# Altium schematic sheet power&down.SchDoc
size A4
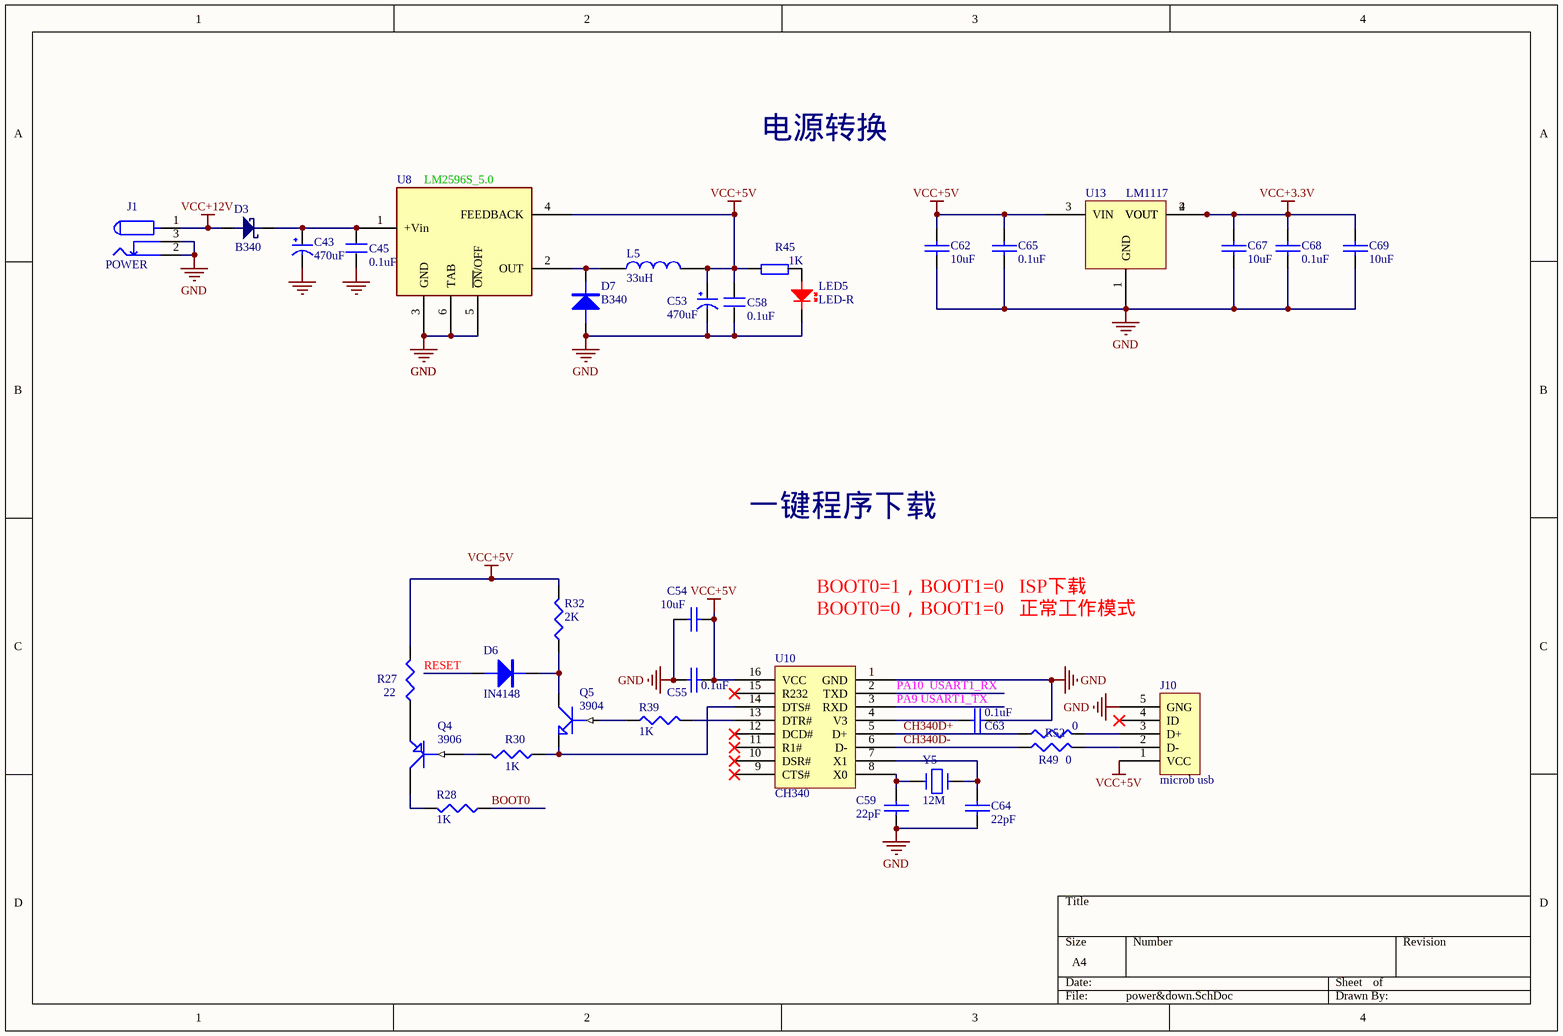
[diagram p0: power&down.SchDoc]

## Parts
C43  470uF  [RB5.0-8]
C45  0.1uF  [0603]
C53  470uF  [RB5.0-8]
C54  10uF  [0805]
C55  0.1uF  [0603]
C58  0.1uF  [0603]
C59  22pF  [0603]
C62  10uF  [0805]
C63  0.1uF  [0603]
C64  22pF  [0603]
C65  0.1uF  [0603]
C67  10uF  [0805]
C68  0.1uF  [0603]
C69  10uF  [0805]
D3  B340  [SMB]
D6  IN4148  [SOD-23]
D7  B340  [SMB]
J1  POWER  [DC10B]
J10  microb usb  [USB_micro]
L5  33uH  [INDUCTOR-1212]
LED5  LED-R  [LED-0805]
Q4  3906  [SOT-23]
Q5  3904  [SOT-23]
R27  22  [0603]
R28  1K  [0603]
R30  1K  [0603]
R32  2K  [0603]
R39  1K  [0603]
R45  1K  [0603]
R49  0  [0603]
R52  0  [0603]
U8  LM2596S_5.0  [TO-263-5]
U10  CH340  [SOP16]
U13  LM1117  [AMS1117]
Y5  12M  [XTAL_US]

## Nets
GND: C43.2(GND) C45.1 C53.2(GND) C54.1 C55.1 C58.1 C59.1 C62.2 C63.1 C64.2 C65.2 C67.2 C68.2 C69.2 D7.1(A) J1.2 J1.3 J10.5(GNG) LED5.2 U8.3(GND) U8.5(~{ON}/OFF) U8.6(TAB) U10.1(GND) U13.1(GND)
VCC+3.3V: C67.1 C68.1 C69.1 U13.2(VOUT) U13.4(VOUT)
VCC+5V: C53.1(VCC) C54.2 C55.2 C58.2 C62.1 C65.1 J10.1(VCC) L5.2 R27.2 R32.2 R45.1 U8.4(FEEDBACK) U10.16(VCC) U13.3(VIN)
VCC+12V: D3.1 J1.1
BOOT0: R28.1
CH340D+: R52.1 U10.5(D+)
CH340D-: R49.1 U10.6(D-)
PA9 USART1_TX: U10.3(RXD)
PA10  USART1_RX: U10.2(TXD)
RESET: D6.1(A)
NetC43_1: C43.1(VCC) C45.2 D3.2 U8.1(+Vin)
NetC59_2: C59.2 U10.8(X0) Y5.1
NetC63_2: C63.2 U10.4(V3)
NetC64_1: C64.1 U10.7(X1) Y5.2
NetD6_2: D6.2(K) Q5.3(C) R32.1
NetD7_2: D7.2(K) L5.1 U8.2(OUT)
NetJ10_2: J10.2(D-) R49.2
NetJ10_3: J10.3(D+) R52.2
NetLED5_1: LED5.1 R45.2
NetQ4_1: Q4.1(B) R30.2
NetQ4_2: Q4.2(E) R27.1
NetQ4_3: Q4.3(C) R28.2
NetQ5_1: Q5.1(B) R39.1
NetQ5_2: Q5.2(E) R30.1 U10.14(DTS#)
NetR39_2: R39.2 U10.13(DTR#)

Not connected (* = marked no-connect by the designer): J10 4(ID)*; U10 9(CTS#)* 10(DSR#)* 11(R1#)* 12(DCD#)* 15(R232)*

## Notes on the sheet
- 电源转换
- 一键程序下载
- BOOT0=1，BOOT1=0   ISP下载
  BOOT0=0，BOOT1=0   正常工作模式

## Library data of the parts
C43 C53 C55 C62 C63 C65 C67-C69 = CAP
C45 C58 = C
C54 C59 C64 = CAP: 0.1uF
D3 = 1N5824(SS54): 肖特基二极管
D6 D7 = DIODE
J1 = POW
L5 = INDUCTOR
LED5 = LED-RED: 红色LED
Q4 = PNP1
Q5 = NPN1
R27 R28 R30 R32 R39 R49 R52 = RES1
R45 = Res
U8 = LM2596S_5.0: 3A开关电源芯片
Y5 = CRYSTAL